# EAGLE design f_log_rind (EAGLE 9.6.2)
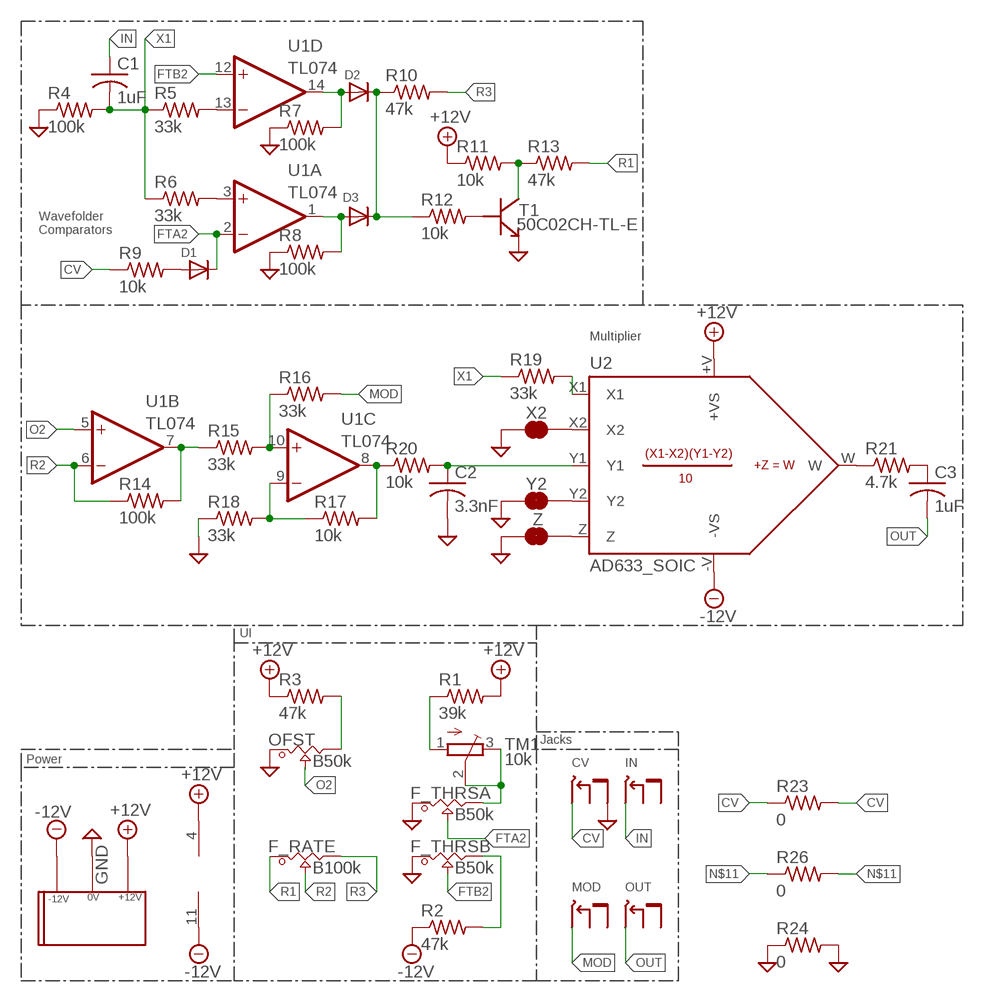
[diagram p0: schematic, sheet 1]

## Parts
C1  1uF  C-USC0603  [C0603]
C2  3.3nF  C-USC0603  [C0603]
C3  1uF  C-USC0603  [C0603]
D1  DIODESOD-123  [SOD-123]
D2  DIODESOD-123  [SOD-123]
D3  DIODESOD-123  [SOD-123]
F_RATE  B100k  POT_9MM_SMD  [POT_9MM_SMD]
F_THRSA  B50k  POT_9MM_SMD  [POT_9MM_SMD]
F_THRSB  B50k  POT_9MM_SMD  [POT_9MM_SMD]
J_A1  THONKICONN_CE_4X_COMG_NOSW  [1.27MM_CE_4X_COMG_NOSW]
OFST  B50k  POT_9MM_SMD  [POT_9MM_SMD]
R1  39k  R-US_R0603  [R0603]
R2  47k  R-US_R0603  [R0603]
R3  47k  R-US_R0603  [R0603]
R4  100k  R-US_R0603  [R0603]
R5  33k  R-US_R0603  [R0603]
R6  33k  R-US_R0603  [R0603]
R7  100k  R-US_R0603  [R0603]
R8  100k  R-US_R0603  [R0603]
R9  10k  R-US_R0603  [R0603]
R10  47k  R-US_R0603  [R0603]
R11  10k  R-US_R0603  [R0603]
R12  10k  R-US_R0603  [R0603]
R13  47k  R-US_R0603  [R0603]
R14  100k  R-US_R0603  [R0603]
R15  33k  R-US_R0603  [R0603]
R16  33k  R-US_R0603  [R0603]
R17  10k  R-US_R0603  [R0603]
R18  33k  R-US_R0603  [R0603]
R19  33k  R-US_R0603  [R0603]
R20  10k  R-US_R0603  [R0603]
R21  4.7k  R-US_R0603  [R0603]
R23  0  R-US_R0402  [R0402]
R24  0  R-US_R0402  [R0402]
R26  0  R-US_R0402  [R0402]
T1  50C02CH-TL-E  [BEC]
TM1  10k  TRIMPOTTC33X  [TC33X]
U1  TL074  TL074_SMD  [SO14]
U2  AD633_SOIC  [SOIC_8]
U$1  EURO_POW_CEH  [EURO_POW_CEH]
X2  JUMPER-SMT_2_NC_TRACE_NO-SILK  [SMT-JUMPER_2_NC_TRACE_NO-SILK]
Y2  JUMPER-SMT_2_NC_TRACE_NO-SILK  [SMT-JUMPER_2_NC_TRACE_NO-SILK]
Z  JUMPER-SMT_2_NC_TRACE_NO-SILK  [SMT-JUMPER_2_NC_TRACE_NO-SILK]

## Nets
+12V: R1.2 R3.1 R11.1 U1.4(P:V+) U2.+V(+VS) U$1.+12V
-12V: R2.1 U1.11(P:V-) U2.-V(-VS) U$1.-12V
A1A+: R6.2 U1.3(A:+IN)
A1AO: D3.A R8.2 U1.1(A:OUT)
A1BO: R14.2 R15.1 U1.7(B:OUT)
A1C+: R15.2 R16.1 U1.10(C:+IN)
A1C-: R17.1 R18.2 U1.9(C:-IN)
A1CO: R17.2 R20.1 U1.8(C:OUT)
A1D-: R5.2 U1.13(D:-IN)
A1DO: D2.A R7.2 U1.14(D:OUT)
CV: J_A1.1(T) R9.1 R23.1 R23.2
FTA2: D1.C F_THRSA.2 U1.2(A:-IN)
FTB2: F_THRSB.2 U1.12(D:+IN)
GND: C2.2 F_THRSA.1 F_THRSB.1 J_A1.0(S) OFST.1 R4.1 R7.1 R8.1 R18.1 R24.1 R24.2 T1.E U$1.GND X2.1 Y2.1 Z.1
IN: C1.1 J_A1.2(T)
MOD: J_A1.3(T) R16.2
N$1: F_THRSA.3 TM1.2(S) TM1.3(E)
N$2: R1.1 TM1.1(A)
N$3: F_THRSB.3 R2.2
N$4: OFST.3 R3.2
N$5: U2.Z Z.2
N$6: R21.1 U2.W
N$7: C3.1 R21.2
N$10: D1.A R9.2
N$11: D2.C D3.C R10.1 R12.1 R26.1 R26.2
N$12: R12.2 T1.B
N$13: R11.2 R13.1 T1.C
N$15: U2.Y2 Y2.2
N$19: U2.X2 X2.2
N$20: R19.2 U2.X1
O2: OFST.2 U1.5(B:+IN)
OUT: C3.2 J_A1.4(T)
R1: F_RATE.1 R13.2
R2: F_RATE.2 R14.1 U1.6(B:-IN)
R3: F_RATE.3 R10.2
X1: C1.2 R4.2 R5.1 R6.1 R19.1
Y1: C2.1 R20.2 U2.Y1

## Notes on the sheet
- Wavefolder
  Comparators
- Multiplier
- UI
- Jacks
- Power | CV | IN
- MOD | OUT

## Library data of the parts
C1-C3 = adafruit:C-US: CAPACITOR, American symbol
D1-D3 = adafruit:DIODE: Diode SMADIODE - SMA Surface Mount Package 20V 1A Schottky Diode Digikey: 641-1014-6-ND DO-1N4148 - Through Hole Small Current Diode SOD-123 20V 1 A (.5mV Vf) Schottky Diode - Digikey: MBRX120TPMSCT-ND SOD-323 10V 570mA (.38mV Vf, 3ns) Schottky Diode - Digikey: ZLLS410CT-ND SOD-523 30V 30mA Schottky Diode (RB751S-40TE61) - Digikey: RB751S-40TE61CT-ND SOT23-R/W - SOT23 Package (R = Solder Paste/Reflow Ovens, W = Hand-Soldering) BAT54Film 40V 300mA - Digikey: 497-7162-1-ND
F_RATE F_THRSA F_THRSB OFST = Mech_BO_CE_SW:POT_9MM_SMD
J_A1 = THONKICONN_BE:THONKICONN_CE_4X_COMG_NOSW
R1-R21 R23 R24 R26 = adafruit:R-US_: RESISTOR, American symbol
T1 = SOT23_TRANS:50C02CH-TL-E
TM1 = adafruit:TRIMPOT: SMT trimmer potentiometer part number TC33X http://www.ladyada.net/library/eagle
U1 = MusicThingModular:TL074: Generic Quad Op Amp
U2 = ad633:AD633_SOIC
U$1 = 2.54mm_PowHeader_SMD:EURO_POW_CEH: Eurorack Power Header Reduced Card Edge Surface Mount Pads
X2 Y2 Z = SparkFun-Jumpers:JUMPER-SMT_2_NC_TRACE: Normally closed trace jumper This jumper has a trace between two pads so it's normally closed (NC). Use a razor knife to open the connection. For best results follow the IPC guidelines for cutting traces: Cutout at least 0.063 mm (0.005 in). Remove all loose material to clean up the cut area. Seal the cut with an approved epoxy. Reapply solder to reclose the connection.

## Board
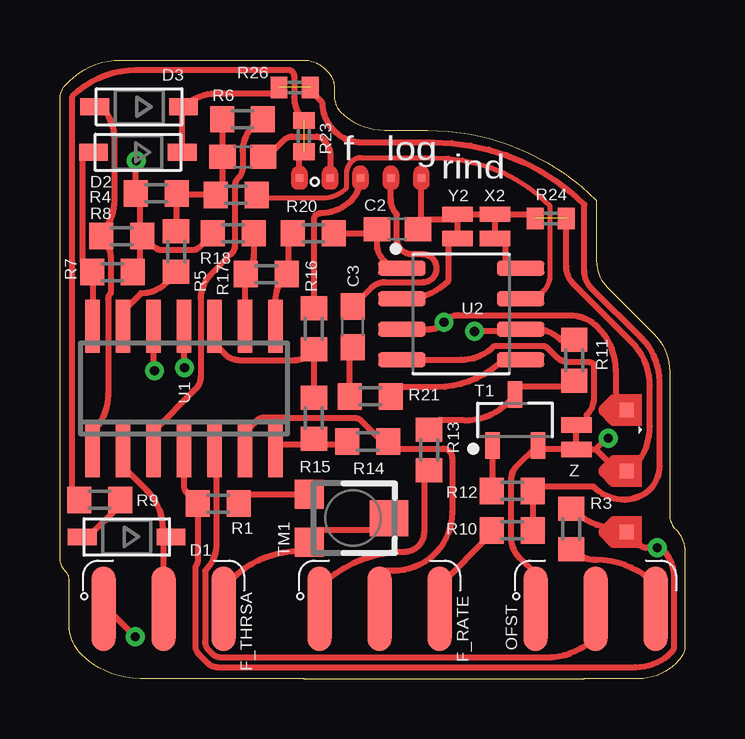
[diagram p1: board, top side]
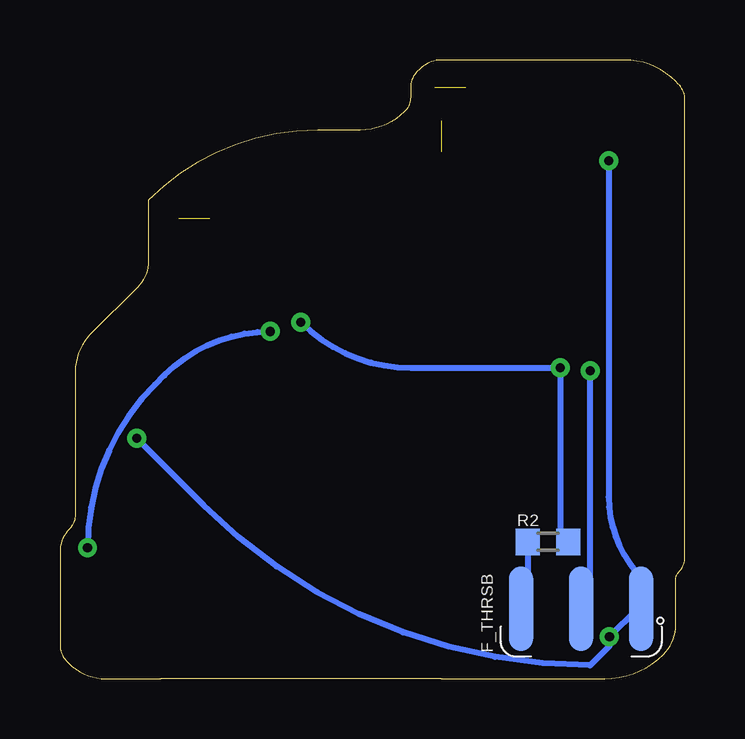
[diagram p2: board, bottom side, seen from below]

Size 26.04 x 25.78 mm. Coordinates in mm from the lower left corner, seen from the top.
Outline: 10.16,0 21.84,0 24.12,0 arc45 25.65,0.64 25.77,0.75 arc45 26.04,1.4 26.04,5.3 arc45 25.65,6.22 arc-45 25.4,6.84 25.4,12.82 arc45 24.77,14.35 22.8,16.32 arc-45 22.35,17.4 22.35,19.94 arc45 15.3,22.86 13.52,22.86 arc-45 11.68,23.62 arc-45 11.43,24.23 11.43,24.64 arc45 11.16,25.29 11.05,25.4 arc45 10.13,25.78 2.53,25.78 arc45 0.38,24.89 0.27,24.78 arc45 0,24.13 0,5.97 0,5.06 arc45 0.25,4.45 arc-45 0.38,4.14 0.38,2.24 arc45 0.89,1.02 arc45 3.34,0 10.16,0
Copper layers (1*16): Top 0.035mm / dielectric 1.5mm / Bottom 0.035mm
Design rules "default *": minimum track width 6mil, minimum drill 0.35mm, track to track 6mil, track to pad 6mil, pad to pad 6mil, via to via 6mil, smd to smd 6mil, copper to edge 10mil, drill to drill 6mil, minimum pad ring 10mil, minimum via ring 8mil, stop-mask expansion 4mil, vias tented up to drill 0mil, thermal gap 10mil

### Footprints (pad centres in the part's own frame; a part is rotated, then mirrored left to right if it is on the bottom)
C0603 = smd 1.1 x 1: 1 -0.85,0; 2 0.85,0
SOD-123 = smd 1.2 x 0.7: A 1.85,0; C -1.85,0
POT_9MM_SMD = smd 0.991 x 3.505: 1 -2.5,0; 2 0,0; 3 2.5,0
1.27MM_CE_4X_COMG_NOSW = smd 0.318 x 0.318: 0 5.08,0; 1 0,0; 2 1.27,0; 3 2.54,0; 4 3.81,0
R0603 = smd 1 x 1.1: 1 -0.85,0; 2 0.85,0
R0402 = smd 0.7 x 0.9: 1 -0.65,0; 2 0.65,0
BEC = smd 1.099 x 0.602: B -1.065,0.95; C 1.065,0; E -1.065,-0.95
TC33X = smd 1.2 x 1.2: 1 -1,-1.825; 3 1,-1.825 | smd 1.5 x 1.6: 2 0,1.5
SO14 = smd 0.6 x 2.2: 1 -3.81,-2.6; 2 -2.54,-2.6; 3 -1.27,-2.6; 4 0,-2.6; 5 1.27,-2.6; 6 2.54,-2.6; 7 3.81,-2.6; 8 3.81,2.6; 9 2.54,2.6; 10 1.27,2.6; 11 0,2.6; 12 -1.27,2.6; 13 -2.54,2.6; 14 -3.81,2.6
SOIC_8 = smd 1.968 x 0.602: +V 2.473,-0.635; -V -2.473,-0.635; W 2.473,-1.905; X1 2.473,0.635; X2 2.473,1.905; Y1 -2.473,1.905; Y2 -2.473,0.635; Z -2.473,-1.905
EURO_POW_CEH = smd 0.6 x 0.6: +12V 0,-3.175; -12V 5.08,-3.175; GND 2.54,-3.175
SMT-JUMPER_2_NC_TRACE_NO-SILK = smd 0.635 x 1.27: 1 -0.508,0; 2 0.508,0

### Placement (x,y rotation side)
C1  7.62,21.75 180 top
C2  14.06,18.74 0 top
C3  12.2,14.66 90 top
D1  2.78,5.91 180 top
D2  3.25,21.93 180 top
D3  3.3,23.83 180 top
F_RATE  13.32,2.92 0 top
F_THRSA  4.32,2.92 0 top
F_THRSB  4.32,2.92 180 bottom
J_A1  9.98,20.86 0 top
OFST  22.32,2.92 0 top
R1  6.59,7.29 180 top
R2  5.7,5.7 180 bottom
R3  21.3,6.24 270 top
R4  4.01,20.22 0 top
R5  4.84,17.8 270 top
R6  7.61,23.31 0 top
R7  2.19,16.94 180 top
R8  2.57,18.44 180 top
R9  1.65,7.45 0 top
R10  18.85,6.18 180 top
R11  21.43,13.27 270 top
R12  18.85,7.83 180 top
R13  15.38,9.53 270 top
R14  12.82,9.89 180 top
R15  10.58,10.86 90 top
R16  10.58,14.59 90 top
R17  8.6,16.86 0 top
R18  7.22,18.56 0 top
R19  7.34,20.16 0 top
R20  10.56,18.56 0 top
R21  12.93,11.77 180 top
R23  10.16,22.61 90 top
R24  20.45,19.18 0 top
R26  9.78,24.64 0 top
T1  18.96,10.78 90 top
TM1  12.21,6.69 270 top
U1  5.17,12.09 0 top
U2  16.72,15.2 0 top
U$1  20.44,6.11 90 top
X2  18.12,18.85 270 top
Y2  16.56,18.85 270 top
Z  21.51,10.06 90 top

### Tracks (layer width: path | path; a pad name or v marks a point on that pad's centre or on a via)
+12V  (via drill 0.38)
  Top 0.254: R3.1 arc45 23.36,6.24 23.48,6.11 U$1.+12V 24.16,5.57 arc45 24.43,5.46 v24.89,5.46 25.07,5.46 arc-45 25.59,4.19 25.59,1.38 arc-45 25.48,1.1 arc-45 23.99,0.48 6.54,0.48 arc-45 6.18,0.63 5.79,1.03 arc-45 5.64,1.39 5.64,4.67 arc45 5.74,4.92 R1.2 5.28,7.76 arc-45 5.17,8.03 U1.4 | R11.1 20.86,14.12 arc45 19.79,14.56 U2.+V 19.1,14.47 v17.27,14.47
  Bottom 0.254: v24.89,5.46 arc45 22.07,12.26 21.68,12.64 arc45 v17.27,14.47
-12V  (via drill 0.38)
  Top 0.254: U2.-V 15.39,14.56 arc45 15.93,14.79 v16,14.86 16,14.89 arc-45 16.61,15.14 21.25,15.14 arc-45 22.38,14.68 arc-45 23.15,12.82 23.15,11.66 U$1.-12V | v5.19,12.95 5.17,12.97 U1.11
  Bottom 0.254: v16,14.86 arc-45 11.4,12.95 v5.19,12.95 5.19,6.04 R2.1
A1A+
  Top 0.254: U1.3 3.9,10.32 5.63,12.05 arc45 5.86,12.59 5.86,15.83 arc-45 6.27,16.83 7.14,17.7 arc45 7.29,18.06 7.29,20.52 arc-45 7.44,20.88 7.46,20.9 arc45 7.61,21.26 7.61,22 arc-45 8.03,23.01 8.33,23.31 R6.2
A1AO
  Top 0.254: D3.A 1.73,23.83 arc-45 2.28,22.5 2.28,19.92 arc-45 1.72,18.57 R8.2 arc-45 2.12,17.48 2.12,16.08 arc45 2.01,15.81 2.01,11.86 arc-45 1.36,10.29 U1.1
A1BO
  Top 0.254: U1.7 9.23,9.74 10.31,9.74 R15.1 10.83,9.76 11.84,9.76 R14.2
A1C+
  Top 0.254: R15.2 R16.1 10.34,13.5 arc-45 9.8,13.28 7.44,13.28 arc-45 6.91,13.5 6.44,13.97 U1.10
A1C-
  Top 0.254: R18.2 8.07,17.65 arc-45 7.75,16.88 R17.1 arc45 7.71,16.76 U1.9
A1CO
  Top 0.254: U1.8 8.98,15.73 arc-45 R17.2 9.45,17.2 9.51,17.26 9.51,18.36 R20.1
A1D-
  Top 0.254: R5.2 4.84,16.9 4.45,16.51 arc-45 3.38,16.07 2.63,15.32 U1.13
A1DO
  Top 0.254: U1.14 1.36,16.92 R7.2 1.01,17.27 arc-45 0.94,17.45 0.94,21.77 1.1,21.93 D2.A
CV  (1 unrouted)
  Top 0.254: J_A1.1 9.98,21.77 R23.1 | R9.1 0.8,7.49 0.52,7.77 0.52,24.27 arc-45 3.17,25.37 9.5,25.37 arc-90 9.76,25.11 9.76,24.23 arc45 R23.2
FTA2
  Top 0.254: U1.2 2.63,8.84 3.61,7.85 arc-45 4.27,6.26 D1.C 4.32,5.6 F_THRSA.2
FTB2  (via drill 0.38)
  Top 0.254: v3.94,12.83 3.9,12.87 U1.12
  Bottom 0.254: F_THRSB.2 3.94,3.3 v3.94,12.83
GND  (via drill 0.38)  (1 unrouted)
  Top 0.254: R8.1 3.32,18.54 3.32,20.06 R4.1 3.16,21.57 v3.17,21.59 | R8.1 3.32,18.34 3.32,17.22 R7.1 | R18.1 5.75,17.95 arc-45 5.57,17.87 4.18,17.87 arc-45 4,17.95 3.5,18.44 R8.1 | C2.2 15.04,18.86 15.04,19.12 | 15.04,19.12 15.04,20.84 J_A1.0 | 22.33,9.55 Z.1 20.08,9.55 T1.E 19.89,9.71 19.02,8.85 arc45 18.79,8.31 18.79,5.89 arc45 19.14,5.04 19.82,4.37 OFST.1 | 22.33,9.55 23.23,8.65 U$1.GND 23.75,8.65 23.83,8.73 arc45 24.57,10.52 24.57,12.22 arc45 23.83,14.02 21.39,16.45 arc-45 21.1,17.17 R24.2 | 15.04,19.12 16.35,19.12 Y2.1 X2.1 19.62,19.36 R24.1 | F_THRSB.1 1.97,2.92 v3.14,1.75 | 22.33,9.55 22.8,10.02 v22.84,10.02
  Bottom 0.254: v22.84,10.02 20.05,7.23 arc-45 3.94,0.56 3.14,1.36 v3.14,1.75 1.97,2.92 F_THRSB.1 1.78,2.96 1.78,4.19 arc45 3.17,7.56 v3.17,21.59
IN
  Top 0.254: J_A1.2 11.27,20.89 11.27,21.75 arc45 10.97,22.46 arc45 10.68,22.59 9.68,22.59 arc45 9.32,22.44 8.63,21.75 C1.1
MOD
  Top 0.254: R16.2 10.58,19.13 arc-90 10.84,19.39 arc45 12.13,19.93 arc45 J_A1.3
N$1
  Top 0.254: TM1.2 13.2,6.18 10.62,6.18 10.38,5.95 TM1.3 10,5.31 arc45 7.13,4.12 6.82,3.81 F_THRSA.3
N$2
  Top 0.254: R1.1 7.84,7.69 TM1.1
N$3
  Bottom 0.254: R2.2 6.55,3.19 F_THRSB.3
N$4
  Top 0.254: R3.2 arc45 22.36,4.95 arc-45 24.79,3.94 24.82,3.92 OFST.3
N$5
  Top 0.254: U2.Z 16.7,13.29 arc45 18.1,13.87 20.06,13.87 arc-45 20.33,13.76 20.67,13.42 arc45 21.21,13.2 21.99,13.2 arc-45 22.26,13.09 22.26,11.74 arc-45 21.94,10.98 21.94,10.75 21.77,10.57 Z.2
N$6
  Top 0.254: U2.W 19.17,13.31 18.49,13.31 arc-45 15.69,12.15 14.16,12.15 R21.1
N$7
  Top 0.254: R21.2 12.07,13.69 C3.1
N$10
  Top 0.254: R9.2 2.5,7.22 1.18,5.91 D1.A
N$11  (1 unrouted)
  Top 0.254: D2.C 5.1,23.78 D3.C arc-45 6.48,24.38 8.88,24.38 R26.1 | 19.7,7.75 R12.1 19.86,8 | 19.7,7.75 R10.1 | R26.2 10.43,24.51 10.92,24.02 arc90 12.59,22.35 15.57,22.35 arc-45 21.84,19.75 21.84,17 arc45 22.14,16.28 24.24,14.18 arc-45 24.98,12.39 24.98,8.89 arc-90 23.54,7.46 arc-45 22.23,8 19.95,8 19.7,7.75
N$12
  Top 0.254: T1.B 18.01,7.84 R12.2
N$13
  Top 0.254: R13.1 15.76,10.76 16.84,10.76 arc45 18.68,11.53 18.77,11.53 18.96,11.72 T1.C 18.96,12.1 19.03,12.17 21.17,12.17 R11.2
N$15
  Top 0.254: Y2.2 16.3,18.34 16.18,18.21 16.18,16.57 arc-45 14.4,15.83 U2.Y2
N$19
  Top 0.254: X2.2 18.37,18.34 18.54,18.17 18.54,17.14 18.58,17.1 U2.X2
N$20
  Top 0.2: R19.2 8.31,20.03 10.94,20.03 arc45 11.94,20.45 11.94,21.02 arc-45 12.16,21.56 arc-45 12.54,21.72 15.57,21.72 arc-45 20.43,19.7 20.43,16.85 arc-90 19.41,15.83 U2.X1
O2
  Top 0.254: OFST.2 22.32,1.74 arc-45 20.25,0.89 6.71,0.89 arc-45 6.35,1.04 6.19,1.19 arc-45 6.04,1.55 6.04,4.5 arc45 6.52,5.65 6.52,9.41 U1.5
OUT
  Top 0.254: C3.2 12.99,16.3 arc-45 13.53,16.52 15.13,16.52 arc90 15.7,17.09 arc90 15.11,17.68 14.67,17.68 arc-90 14.04,18.32 14.04,19.35 arc-45 13.79,19.96 J_A1.4
R1
  Top 0.254: R13.2 15.17,8.47 15.17,6.11 arc-90 14.34,5.28 arc45 10.82,3.82 F_RATE.1
R2
  Top 0.254: F_RATE.2 13.32,4.43 13.38,4.49 13.89,4.49 arc90 16.34,6.94 16.34,9.21 arc90 15.96,9.59 13.97,9.59 R14.1 13.41,9.89 12.55,10.75 arc45 12.28,10.86 9.4,10.86 9.39,10.87 8.47,10.87 arc45 8.2,10.76 7.71,10.27 U1.6
R3
  Top 0.254: R10.2 18,6.06 15.82,3.88 F_RATE.3
X1
  Top 0.254: R5.1 4.84,20.2 R4.2 4.92,20.16 R19.1 6.77,20.44 C1.2 R6.1
Y1
  Top 0.254: U2.Y1 arc-90 13.21,18.14 13.21,18.54 | 13.21,18.54 C2.1 | 13.21,18.54 13.19,18.56 R20.2

### Text on the board
tPlace: f | log | rind